# EAGLE schematic spider_mx8_2side_serial (EAGLE 6.5.0)
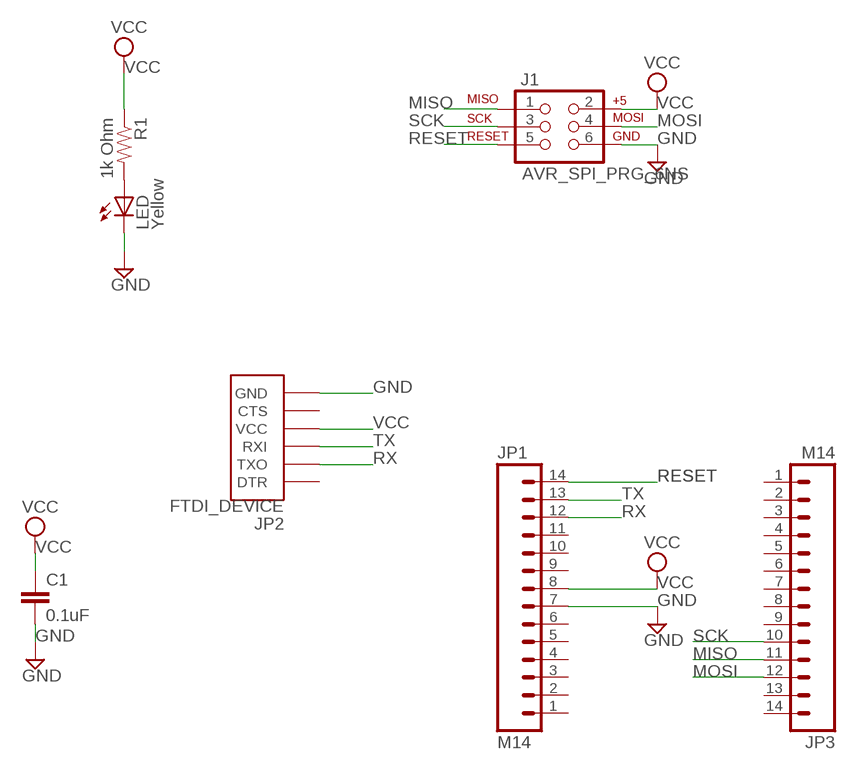
[diagram p0: schematic, sheet 1]

## Parts
C1  0.1uF  CAP1206  [1206]
J1  AVR_SPI_PRG_6NS  [2X3-NS]
JP1  M14  [1X14]
JP2  FTDI_DEVICE  [FTDI_DEVICE_SIDE]
JP3  M14  [1X14]
LED  Yellow  LED-YELLOWLILYPAD  [LED-1206]
R1  1k Ohm  RESISTOR1206  [1206]

## Nets
GND: C1.2 J1.6 JP1.7 JP2.P$6(GND) LED.C
MISO: J1.1 JP3.11
MOSI: J1.4 JP3.12
N$14: LED.A R1.2
RESET: J1.5 JP1.14
RX: JP1.12 JP2.P$2(TXO)
SCK: J1.3 JP3.10
TX: JP1.13 JP2.P$3(RXI)
VCC: C1.1 J1.2 JP1.8 JP2.P$4(VCC) R1.1
Unconnected: JP1.1 JP1.2 JP1.3 JP1.4 JP1.5 JP1.6 JP1.9 JP1.10 JP1.11 JP2.P$1(DTR) JP2.P$5(CTS) JP3.1 JP3.2 JP3.3 JP3.4 JP3.5 JP3.6 JP3.7 JP3.8 JP3.9 JP3.13 JP3.14

## Library data of the parts
C1 = SparkFun-Passives:CAP: Capacitor Standard 0603 ceramic capacitor, and 0.1" leaded capacitor.
J1 = SparkFun-Connectors:AVR_SPI_PRG_6: AVR ISP 6 Pin This is the reduced ISP connector for AVR programming. Common on Arduino. This footprint will take up less PCB space and can be used with a 10-pin to 6-pin adapter such as SKU: BOB-08508
JP1 JP3 = SparkFun-Connectors:M14: Header 14 Standard 14-pin 0.1" header. Use with straight break away headers (SKU : PRT-00116), right angle break away headers (PRT-00553), swiss pins (PRT-00743), machine pins (PRT-00117), and female headers (PRT-00115).
JP2 = SparkFun-Connectors:FTDI_DEVICE: Connector which mates to FTDI basic or FTDI cable.
LED = SparkFun-LED:LED-YELLOW: Yellow SMD LEDs LilyPad 1206- DIO-09909 0603- DIO-09003; PROD_ID: DIO-09909
R1 = SparkFun-Passives:RESISTOR: Resistor Basic schematic elements and footprints for 0603, 1206, and PTH resistors.